# Altium schematic sheet Sheet1.SchDoc
size A3; DocumentNumber: 1; SheetNumber: 1; SheetTotal: 2
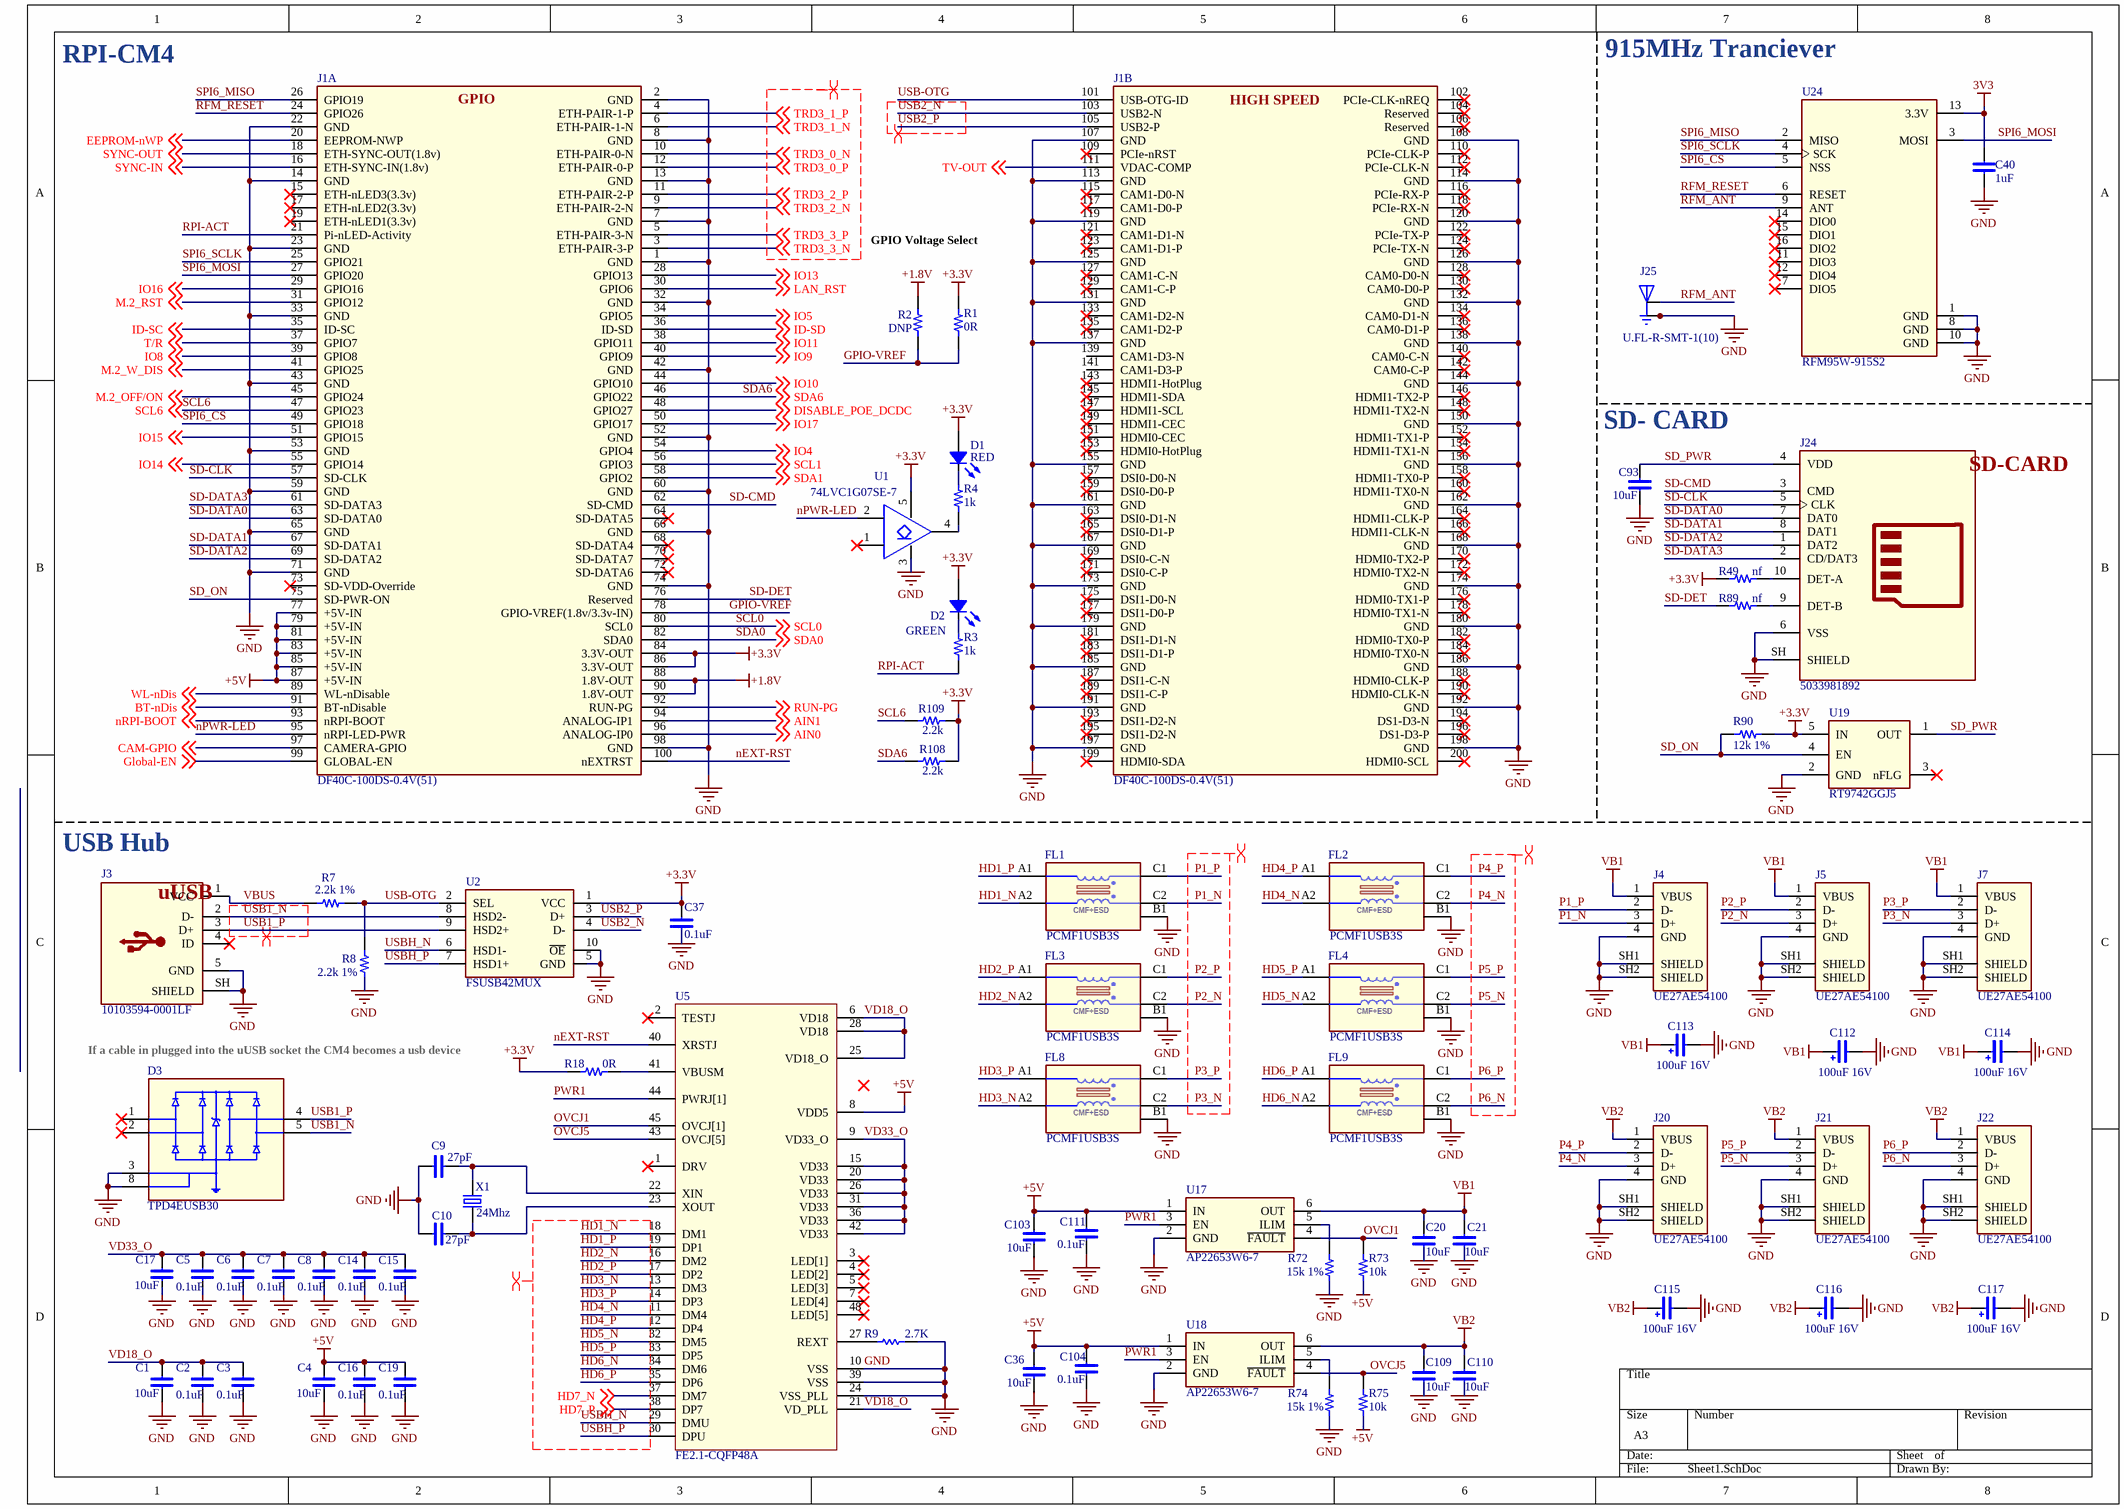
[diagram p0: Sheet1.SchDoc]

## Parts
C1  10uF  [C-0603/1608]
C2  0.1uF  [C-0402/1005]
C3  0.1uF  [C-0402/1005]
C4  10uF  [C-0603/1608]
C5  0.1uF  [C-0402/1005]
C6  0.1uF  [C-0402/1005]
C7  0.1uF  [C-0402/1005]
C8  0.1uF  [C-0402/1005]
C9  27pF  [C-0402/1005]
C10  27pF  [C-0402/1005]
C14  0.1uF  [C-0402/1005]
C15  0.1uF  [C-0402/1005]
C16  0.1uF  [C-0402/1005]
C17  10uF  [C-0603/1608]
C19  0.1uF  [C-0402/1005]
C20  10uF  [C-0603/1608]
C21  10uF  [C-0603/1608]
C36  10uF  [C-0603/1608]
C37  0.1uF  [C-0402/1005]
C40  1uF  [C-0402/1005]
C93  10uF  [C-0805/2012]
C103  10uF  [C-0603/1608]
C104  0.1uF  [C-0402/1005]
C109  10uF  [C-0603/1608]
C110  10uF  [C-0603/1608]
C111  0.1uF  [C-0402/1005]
C112  100uF 16V  [CAP-TAN-2312]
C113  100uF 16V  [CAP-TAN-2312]
C114  100uF 16V  [CAP-TAN-2312]
C115  100uF 16V  [CAP-TAN-2312]
C116  100uF 16V  [CAP-TAN-2312]
C117  100uF 16V  [CAP-TAN-2312]
D1  RED  [LED-0603-RED]
D2  GREEN  [LED-0603-Green]
D3  TPD4EUSB30  [10-USON (2.5x1)]
FL1  PCMF1USB3S  [WLCSP5(2-1-2)_NEX]
FL2  PCMF1USB3S  [WLCSP5(2-1-2)_NEX]
FL3  PCMF1USB3S  [WLCSP5(2-1-2)_NEX]
FL4  PCMF1USB3S  [WLCSP5(2-1-2)_NEX]
FL8  PCMF1USB3S  [WLCSP5(2-1-2)_NEX]
FL9  PCMF1USB3S  [WLCSP5(2-1-2)_NEX]
J1  DF40C-100DS-0.4V(51)  [RPI-CM4]  (parts A,B of 2)
J3  10103594-0001LF  [USB-micro]
J4  UE27AE54100  [AMPHENOL_UE27AE54100]
J5  UE27AE54100  [AMPHENOL_UE27AE54100]
J7  UE27AE54100  [AMPHENOL_UE27AE54100]
J20  UE27AE54100  [AMPHENOL_UE27AE54100]
J21  UE27AE54100  [AMPHENOL_UE27AE54100]
J22  UE27AE54100  [AMPHENOL_UE27AE54100]
J24  5033981892  [MOLEX-503398-1892]
J25  U.FL-R-SMT-1(10)  [HRS_U.FL-R-SMT-1(10)]
R1  0R  [R-0603/1608]
R2  DNP  [R-0603/1608]
R3  1k  [R-0402/1005]
R4  1k  [R-0402/1005]
R7  2.2k 1%  [R-0402/1005]
R8  2.2k 1%  [R-0402/1005]
R9  value 2.7K  [R-0402/1005]
R18  0R  [R-0402/1005]
R49  nf  [R-0402/1005]
R72  15k 1%  [R-0402/1005]
R73  10k  [R-0402/1005]
R74  15k 1%  [R-0402/1005]
R75  10k  [R-0402/1005]
R89  nf  [R-0402/1005]
R90  12k 1%  [R-0402/1005]
R108  2.2k  [R-0402/1005]
R109  2.2k  [R-0402/1005]
U1  74LVC1G07SE-7  [SOT-353]
U2  FSUSB42MUX  [10-MSOP-W3.0mm]
U5  FE2.1-CQFP48A  [PCBComponent_1]
U17  AP22653W6-7  [SOT-23-6]
U18  AP22653W6-7  [SOT-23-6]
U19  RT9742GGJ5  [SOT-23-5]
U24  RFM95W-915S2  [XCVR_RFM95W-915S2]
X1  24Mhz  [HC-49/US]

## Nets
3V3: C40.1 U24.13(3.3V)
+1.8V: J1.88(1.8V-OUT) J1.90(1.8V-OUT) R2.2
+3.3V: C37.1 D1.1 D2.1 J1.84(3.3V-OUT) J1.86(3.3V-OUT) R1.2 R18.1 R49.2 R90.1 R108.1 R109.1 U1.5 U2.1(VCC) U19.5(IN)
+5V: C4.1 C16.1 C19.1 C36.1 C103.1 C104.1 C111.1 J1.77(+5V-IN) J1.79(+5V-IN) J1.81(+5V-IN) J1.83(+5V-IN) J1.85(+5V-IN) J1.87(+5V-IN) R73.2 R75.2 U5.8(VDD5) U17.1(IN) U18.1(IN)
GND: C1.2 C2.2 C3.2 C4.2 C5.2 C6.2 C7.2 C8.2 C9.2 C10.2 C14.2 C15.2 C16.2 C17.2 C19.2 C20.2 C21.2 C36.2 C37.2 C40.2 C93.2 C103.2 C104.2 C109.2 C110.2 C111.2 C112.- C113.- C114.- C115.- C116.- C117.- D3.3(GND_3) D3.8(GND_8) FL1.B1(GND) FL2.B1(GND) FL3.B1(GND) FL4.B1(GND) FL8.B1(GND) FL9.B1(GND) J1.1(GND) J1.2(GND) J1.7(GND) J1.8(GND) J1.13(GND) J1.14(GND) J1.22(GND) J1.23(GND) J1.32(GND) J1.33(GND) J1.42(GND) J1.43(GND) J1.52(GND) J1.53(GND) J1.59(GND) J1.60(GND) J1.65(GND) J1.66(GND) J1.71(GND) J1.74(GND) J1.98(GND) J1.107(GND) J1.108(GND) J1.113(GND) J1.114(GND) J1.119(GND) J1.120(GND) J1.125(GND) J1.126(GND) J1.131(GND) J1.132(GND) J1.137(GND) J1.138(GND) J1.144(GND) J1.150(GND) J1.155(GND) J1.156(GND) J1.161(GND) J1.162(GND) J1.167(GND) J1.168(GND) J1.173(GND) J1.174(GND) J1.179(GND) J1.180(GND) J1.185(GND) J1.186(GND) J1.191(GND) J1.192(GND) J1.197(GND) J1.198(GND) J3.5(GND) J3.SH(SHIELD) J4.4(GND) J4.SH1(SHIELD) J4.SH2(SHIELD) J5.4(GND) J5.SH1(SHIELD) J5.SH2(SHIELD) J7.4(GND) J7.SH1(SHIELD) J7.SH2(SHIELD) J20.4(GND) J20.SH1(SHIELD) J20.SH2(SHIELD) J21.4(GND) J21.SH1(SHIELD) J21.SH2(SHIELD) J22.4(GND) J22.SH1(SHIELD) J22.SH2(SHIELD) J24.6(VSS) J24.SH(SHIELD) J25.1(GND) J25.3(GND) R8.2 R9.2 R72.1 R74.1 U1.3 U2.5(GND) U2.10(~{OE}) U5.10(VSS) U5.24(VSS_PLL) U5.39(VSS) U17.2(GND) U18.2(GND) U19.2(GND) U24.1(GND) U24.8(GND) U24.10(GND)
VB1: C20.1 C21.1 C112.+ C113.+ C114.+ J4.1(VBUS) J5.1(VBUS) J7.1(VBUS) U17.6(OUT)
VB2: C109.1 C110.1 C115.+ C116.+ C117.+ J20.1(VBUS) J21.1(VBUS) J22.1(VBUS) U18.6(OUT)
AIN0: J1.96(ANALOG-IP0) ; off-sheet AIN0
AIN1: J1.94(ANALOG-IP1) ; off-sheet AIN1
BT-nDis: J1.91(BT-nDisable) ; off-sheet BT-nDis
CAM-GPIO: J1.97(CAMERA-GPIO) ; off-sheet CAM-GPIO
DISABLE_POE_DCDC: J1.48(GPIO27) ; off-sheet DISABLE_POE_DCDC
EEPROM-nWP: J1.20(EEPROM-NWP) ; off-sheet EEPROM-nWP
Global-EN: J1.99(GLOBAL-EN) ; off-sheet Global-EN
GPIO-VREF: J1.78(GPIO-VREF(1.8v/3.3v-IN)) R1.1 R2.1
HD1_N: FL1.A2(CH1_IN-) U5.18(DM1)
HD1_P: FL1.A1(CH1_IN+) U5.19(DP1)
HD2_N: FL3.A2(CH1_IN-) U5.16(DM2)
HD2_P: FL3.A1(CH1_IN+) U5.17(DP2)
HD3_N: FL8.A2(CH1_IN-) U5.13(DM3)
HD3_P: FL8.A1(CH1_IN+) U5.14(DP3)
HD4_N: FL2.A2(CH1_IN-) U5.11(DM4)
HD4_P: FL2.A1(CH1_IN+) U5.12(DP4)
HD5_N: FL4.A2(CH1_IN-) U5.32(DM5)
HD5_P: FL4.A1(CH1_IN+) U5.33(DP5)
HD6_N: FL9.A2(CH1_IN-) U5.34(DM6)
HD6_P: FL9.A1(CH1_IN+) U5.35(DP6)
HD7_N: U5.37(DM7) ; off-sheet HD7_N
HD7_P: U5.38(DP7) ; off-sheet HD7_P
ID-SC: J1.35(ID-SC) ; off-sheet ID-SC
ID-SD: J1.36(ID-SD) ; off-sheet ID-SD
IO4: J1.54(GPIO4) ; off-sheet IO4
IO5: J1.34(GPIO5) ; off-sheet IO5
IO8: J1.39(GPIO8) ; off-sheet IO8
IO9: J1.40(GPIO9) ; off-sheet IO9
IO10: J1.44(GPIO10) ; off-sheet IO10
IO11: J1.38(GPIO11) ; off-sheet IO11
IO13: J1.28(GPIO13) ; off-sheet IO13
IO14: J1.55(GPIO14) ; off-sheet IO14
IO15: J1.51(GPIO15) ; off-sheet IO15
IO16: J1.29(GPIO16) ; off-sheet IO16
IO17: J1.50(GPIO17) ; off-sheet IO17
LAN_RST: J1.30(GPIO6) ; off-sheet LAN_RST
M.2_OFF/ON: J1.45(GPIO24) ; off-sheet M.2_OFF/ON
M.2_RST: J1.31(GPIO12) ; off-sheet M.2_RST
M.2_W_DIS: J1.41(GPIO25) ; off-sheet M.2_W_DIS
nEXT-RST: J1.100(nEXTRST) U5.40(XRSTJ)
nPWR-LED: J1.95(nRPI-LED-PWR) U1.2
nRPI-BOOT: J1.93(nRPI-BOOT) ; off-sheet nRPI-BOOT
OVCJ1: R73.1 U5.45(OVCJ[1]) U17.4(~{FAULT})
OVCJ5: R75.1 U5.43(OVCJ[5]) U18.4(~{FAULT})
P1_N: FL1.C2(CH1_OUT-) J4.3(D+)
P1_P: FL1.C1(CH1_OUT+) J4.2(D-)
P2_N: FL3.C2(CH1_OUT-) J5.3(D+)
P2_P: FL3.C1(CH1_OUT+) J5.2(D-)
P3_N: FL8.C2(CH1_OUT-) J7.3(D+)
P3_P: FL8.C1(CH1_OUT+) J7.2(D-)
P4_N: FL2.C2(CH1_OUT-) J20.3(D+)
P4_P: FL2.C1(CH1_OUT+) J20.2(D-)
P5_N: FL4.C2(CH1_OUT-) J21.3(D+)
P5_P: FL4.C1(CH1_OUT+) J21.2(D-)
P6_N: FL9.C2(CH1_OUT-) J22.3(D+)
P6_P: FL9.C1(CH1_OUT+) J22.2(D-)
PWR1: U5.44(PWRJ[1]) U17.3(EN) U18.3(EN)
RFM_ANT: J25.2(SIG) U24.9(ANT)
RFM_RESET: J1.24(GPIO26) U24.6(RESET)
RPI-ACT: J1.21(Pi-nLED-Activity) R3.2
RUN-PG: J1.92(RUN-PG) ; off-sheet RUN-PG
SCL0: J1.80(SCL0) ; off-sheet SCL0
SCL1: J1.56(GPIO3) ; off-sheet SCL1
SCL6: J1.47(GPIO23) R109.2 ; off-sheet SCL6
SD-CLK: J1.57(SD-CLK) J24.5(CLK)
SD-CMD: J1.62(SD-CMD) J24.3(CMD)
SD-DATA0: J1.63(SD-DATA0) J24.7(DAT0)
SD-DATA1: J1.67(SD-DATA1) J24.8(DAT1)
SD-DATA2: J1.69(SD-DATA2) J24.1(DAT2)
SD-DATA3: J1.61(SD-DATA3) J24.2(CD/DAT3)
SD-DET: J1.76(Reserved) R89.2
SD_ON: J1.75(SD-PWR-ON) R90.2 U19.4(EN)
SD_PWR: C93.1 J24.4(VDD) U19.1(OUT)
SDA0: J1.82(SDA0) ; off-sheet SDA0
SDA1: J1.58(GPIO2) ; off-sheet SDA1
SDA6: J1.46(GPIO22) R108.2 ; off-sheet SDA6
SPI6_CS: J1.49(GPIO18) U24.5(NSS)
SPI6_MISO: J1.26(GPIO19) U24.2(MISO)
SPI6_MOSI: J1.27(GPIO20) U24.3(MOSI)
SPI6_SCLK: J1.25(GPIO21) U24.4(SCK)
SYNC-IN: J1.16(ETH-SYNC-IN(1.8v)) ; off-sheet SYNC-IN
SYNC-OUT: J1.18(ETH-SYNC-OUT(1.8v)) ; off-sheet SYNC-OUT
T/R: J1.37(GPIO7) ; off-sheet T/R
TRD3_0_N: J1.10(ETH-PAIR-0-N) ; off-sheet TRD3_0_N
TRD3_0_P: J1.12(ETH-PAIR-0-P) ; off-sheet TRD3_0_P
TRD3_1_N: J1.6(ETH-PAIR-1-N) ; off-sheet TRD3_1_N
TRD3_1_P: J1.4(ETH-PAIR-1-P) ; off-sheet TRD3_1_P
TRD3_2_N: J1.9(ETH-PAIR-2-N) ; off-sheet TRD3_2_N
TRD3_2_P: J1.11(ETH-PAIR-2-P) ; off-sheet TRD3_2_P
TRD3_3_N: J1.3(ETH-PAIR-3-P) ; off-sheet TRD3_3_N
TRD3_3_P: J1.5(ETH-PAIR-3-N) ; off-sheet TRD3_3_P
TV-OUT: J1.111(VDAC-COMP) ; off-sheet TV-OUT
USB1_N: D3.5(D2-) J3.2(D-) U2.8(HSD2-)
USB1_P: D3.4(D2+) J3.3(D+) U2.9(HSD2+)
USB2_N: J1.103(USB2-N) U2.4(D-)
USB2_P: J1.105(USB2-P) U2.3(D+)
USB-OTG: J1.101(USB-OTG-ID) R7.1 R8.1 U2.2(SEL)
USBH_N: U2.6(HSD1-) U5.29(DMU)
USBH_P: U2.7(HSD1+) U5.30(DPU)
VBUS: J3.1(VCC) R7.2
VD18_O: C1.1 C2.1 C3.1 U5.6(VD18) U5.21(VD_PLL) U5.25(VD18_O) U5.28(VD18)
VD33_O: C5.1 C6.1 C7.1 C8.1 C14.1 C15.1 C17.1 U5.9(VD33_O) U5.15(VD33) U5.20(VD33) U5.26(VD33) U5.31(VD33) U5.36(VD33) U5.42(VD33)
WL-nDis: J1.89(WL-nDisable) ; off-sheet WL-nDis
NetC9_1: C9.1 U5.22(XIN) X1.2
NetC10_1: C10.1 U5.23(XOUT) X1.1
NetD1_2: D1.2 R4.1
NetD2_2: D2.2 R3.1
NetJ24_9: J24.9(DET-B) R89.1
NetJ24_10: J24.10(DET-A) R49.1
NetR4_2: R4.2 U1.4
NetR9_1: R9.1 U5.27(REXT)
NetR18_2: R18.2 U5.41(VBUSM)
NetR72_2: R72.2 U17.5(ILIM)
NetR74_2: R74.2 U18.5(ILIM)

Not connected (* = marked no-connect by the designer): D3 1(D1+)* 2(D1-)*; J1 15(ETH-nLED3(3.3v))* 17(ETH-nLED2(3.3v))* 19(ETH-nLED1(3.3v))* 64(SD-DATA5)* 68(SD-DATA4)* 70(SD-DATA7)* 72(SD-DATA6)* 73(SD-VDD-Override)* 102(PCIe-CLK-nREQ)* 104(Reserved)* 106(Reserved)* 109(PCIe-nRST)* 110(PCIe-CLK-P)* 112(PCIe-CLK-N)* 115(CAM1-D0-N)* 116(PCIe-RX-P)* 117(CAM1-D0-P)* 118(PCIe-RX-N)* 121(CAM1-D1-N)* 122(PCIe-TX-P)* 123(CAM1-D1-P)* 124(PCIe-TX-N)* 127(CAM1-C-N)* 128(CAM0-D0-N)* 129(CAM1-C-P)* 130(CAM0-D0-P)* 133(CAM1-D2-N)* 134(CAM0-D1-N)* 135(CAM1-D2-P)* 136(CAM0-D1-P)* 139(CAM1-D3-N) 140(CAM0-C-N)* 141(CAM1-D3-P) 142(CAM0-C-P)* 143(HDMI1-HotPlug)* 145(HDMI1-SDA)* 146(HDMI1-TX2-P)* 147(HDMI1-SCL)* 148(HDMI1-TX2-N)* 149(HDMI1-CEC)* 151(HDMI0-CEC)* 152(HDMI1-TX1-P)* 153(HDMI0-HotPlug)* 154(HDMI1-TX1-N)* 157(DSI0-D0-N)* 158(HDMI1-TX0-P)* 159(DSI0-D0-P)* 160(HDMI1-TX0-N)* 163(DSI0-D1-N)* 164(HDMI1-CLK-P)* 165(DSI0-D1-P)* 166(HDMI1-CLK-N)* 169(DSI0-C-N)* 170(HDMI0-TX2-P)* 171(DSI0-C-P)* 172(HDMI0-TX2-N)* 175(DSI1-D0-N)* 176(HDMI0-TX1-P)* 177(DSI1-D0-P)* 178(HDMI0-TX1-N)* 181(DSI1-D1-N)* 182(HDMI0-TX0-P)* 183(DSI1-D1-P)* 184(HDMI0-TX0-N)* 187(DSI1-C-N)* 188(HDMI0-CLK-P)* 189(DSI1-C-P)* 190(HDMI0-CLK-N)* 193(DSI1-D2-N)* 194(DS1-D3-N)* 195(DSI1-D2-N)* 196(DS1-D3-P)* 199(HDMI0-SDA)* 200(HDMI0-SCL)*; J3 4(ID)*; U1 1*; U5 1(DRV)* 2(TESTJ)* 3(LED[1])* 4(LED[2])* 5(LED[3])* 7(LED[4])* 48(LED[5])*; U19 3(nFLG)*; U24 7(DIO5)* 11(DIO3)* 12(DIO4)* 14(DIO0)* 15(DIO1)* 16(DIO2)*

## Layout directives
differential pair; differential pair class 90OHM: HD1_N, HD1_P, HD2_N, HD2_P, HD3_N, HD3_P, HD4_N, HD4_P, HD5_N, HD5_P, HD6_N, HD6_P, HD7_N, HD7_P, P1_N, P1_P, P2_N, P2_P, P3_N, P3_P, P4_N, P4_P, P5_N, P5_P, P6_N, P6_P, USB1_N, USB1_P, USB2_N, USB2_P, USBH_N, USBH_P
differential pair; differential pair class 100OHM: TRD3_0_N, TRD3_0_P, TRD3_1_N, TRD3_1_P, TRD3_2_N, TRD3_2_P, TRD3_3_N, TRD3_3_P

## Notes on the sheet
- RPI-CM4
- (near U24) 915MHz Tranciever
- GPIO Voltage Select
- (near C93) SD- CARD
- USB Hub
- If a cable in plugged into the uUSB socket the CM4 becomes a usb device
- (in symbol Nexperia, PCMF1USB3SZ) CMF+ESD
- (in symbol RPICM4, part A) GPIO
- (in symbol RPICM4, part B) HIGH SPEED
- (in symbol USB-Micro) uUSB

## Library data of the parts
C1 C4 C17 C20 C21 C36 C93 C103 C109 C110 = Capacitor-NonPolar: CAP CER 10UF 10V X7R 0805; Mfr. Part No.: GRM21BR71A106KA73K; Unit Price (USD): 0.19; Value: 10uF 10V; Supplier Part No.: 490-14381-1-ND; Supplier: Digikey Electronics
C2 C3 C5-C8 C14-C16 C19 C37 C104 C111 = Capacitor-NonPolar: CAP CER 0.1UF 16V X7R 0402; Mfr. Part No.: GCM155R71C104KA55D; Unit Price (USD): 0.1; Value: 0.1uF 16V; Supplier Part No.: 490-4759-1-ND; Supplier: Digikey Electronics
C9 C10 = Capacitor-NonPolar: CAP CER 27PF 50V CH 0402; Mfr. Part No.: UMK105CH270JVHF; Unit Price (USD): 0.1; Value: 27pF 50V; Supplier Part No.: 587-5076-1-ND; Supplier: Digikey Electronics
C40 = Capacitor-NonPolar: CAP CER 0.1UF 50V X7R 0402; Mfr. Part No.: UMK105B7104KV-FR; Value: 100nF; Unit Price (USD): 0.15; Supplier Part No.: 587-3498-1-ND; Supplier: Digikey Electronics
C112-C117 = Capacitor-Polar: CAP TANT 10UF 10% 16V 1206; Mfr. Part No.: F931C106KAAAJ6; Unit Price (USD): 0.67; Value: 10uF 16V; Supplier Part No.: 478-10723-1-ND; Supplier: Digikey Electronics
D1 = LED SMD: LED RED CLEAR CHIP SMD R/A; Mfr. Part No.: LTST-S270KRKT; Unit Price (USD): 0.24; Supplier Part No.: 160-1479-1-ND; Supplier: Digikey Electronics
D2 = LED SMD: LED GREEN CLEAR CHIP SMD R/A; Mfr. Part No.: LTST-S270KGKT; Unit Price (USD): 0.24; Supplier Part No.: 160-1478-1-ND; Supplier: Digikey Electronics
D3 = TPD4EUSB30: TVS DIODE 5.5V 8V 10USON; Mfr. Part No.: TPD4EUSB30DQAR; Unit Price (USD): 0.79; Supplier Part No.: 296-28063-1-ND; Supplier: Digikey Electronics
FL1-FL4 FL8 FL9 = Nexperia, PCMF1USB3SZ: FLT, SMT, WLCSP5, Common Mode EMI Filters; Supply Voltage: NO; Notes: NC; Value: PCMF1USB3S; Manufacturer: Nexperia; Mounting: SMT; Operating Temperature: -40ºC ~ +125ºC; Subpart Type: Common Mode EMI Filters; Footprint: WLCSP5; Manufacturer Part Number: PCMF1USB3S; Datasheet Link: https://www.nexperia.com/products/esd-protection-tvs-filtering-and-signal-conditioning/emi-solutions-with-integrated-protection/common-mode-filters-with-integrated-protection/PCMF1USB3S.html; Supply Current: NO; Substitutes Allowed: NO; Height: 0.6mm
J1 = RPICM4: CONN RCPT 100POS SMD GOLD; Unit Price (USD): 1.73; Supplier: Digikey Electronics; Supplier Part No.: H11615CT-ND; Mfr. Part No.: DF40C-100DS-0.4V(51)
J3 = USB-Micro: CONN RCPT USB2.0 MICRO B SMD R/A; Unit Price (USD): 0.72; Mfr. Part No.: 10103594-0001LF; Supplier Part No.: 609-4050-1-ND; Supplier: Digikey Electronics
J4 J5 J7 J20-J22 = UE27AE54100: MF: {'manufacturer': u'Amphenol ICC (Commercial Products)'}; Package: None; Price: None; Value: *; MP: UE27AE54100; Availability: Unavailable
J24 = SD-CARD: MICRO SD PUSH/PUSH SMALL 8C; Unit Price (USD): 2.41; Mfr. Part No.: 5033981892; Supplier Part No.: WM11190CT-ND; Supplier: Digikey Electronics
J25 = U.FL-R-SMT-1(10): U.FL Series 6 Ghz 50 Ohm Ultra-small SMT Coaxial Cable Receptacle; Availability: Unavailable; MP: U.FL-R-SMT-1(10); Value: *; Price: None; Package: None
R1 = Resistor: RESA-AS 0805 0R JUMPER 125MW; Mfr. Part No.: CR0805AJ/-000EAS; Unit Price (USD): 0.1; Value: 0R; Supplier Part No.: CR0805AJ/-000EASCT-ND; Supplier: Digikey Electronics
R2 = Resistor: CRGCQ 0402 470R 1%; Value: nf; Unit Price (USD): 0; Mfr. Part No.: nf; Supplier Part No.: nf; Supplier: nf
R3 R4 R49 R73 R75 R89 R108 R109 = Resistor: RES SMD 1K OHM 1% 1/16W 0402; Mfr. Part No.: RC0402FR-071KL; Unit Price (USD): 0.1; Value: 1k; Supplier Part No.: 311-1.00KLRCT-ND; Supplier: Digikey Electronics
R7 R8 = Resistor: RES SMD 2.2K OHM 1% 1/16W 0402; Mfr. Part No.: RT0402FRE072K2L; Unit Price (USD): 0.1; Value: 2.2k 1%; Supplier Part No.: 13-RT0402FRE072K2LCT-ND; Supplier: Digikey Electronics
R9 = Res1: Resistor; Published: 8-Jun-2000; LatestRevisionDate: 17-Jul-2002; LatestRevisionNote: Re-released for DXP Platform.; PackageReference: AXIAL-0.3; Publisher: Altium Limited; PackageDescription: Axial Device, Thru-Hole; 2 Leads; 0.3 in Pin Spacing
R18 = Resistor: RES SMD 2.2K OHM 1% 1/16W 0402; Mfr. Part No.: RT0402FRE072K2L; Value: 2.2k 1%; Unit Price (USD): 0.1; Supplier Part No.: 13-RT0402FRE072K2LCT-ND; Supplier: Digikey Electronics
R72 R74 = Resistor: RES SMD 15K OHM 1% 1/16W 0402; Mfr. Part No.: MCR01MZPF1502; Unit Price (USD): 0.1; Value: 15k 1%; Supplier Part No.: RHM15.0KLTR-ND; Supplier: Digikey Electronics
R90 = Resistor: RES SMD 12K OHM 1% 1/16W 0402; Mfr. Part No.: MCR01MZPF1202; Unit Price (USD): 0.12; Value: 12k 1%; Supplier Part No.: RHM12.0KLCT-ND; Supplier: Digikey Electronics
U1 = 74LVC1G07SE-7: IC BUF NON-INVERT 5.5V SOT353; Unit Price (USD): 0.26; Mfr. Part No.: 74LVC1G07SE-7; Supplier Part No.: 74LVC1G07SE-7DICT-ND; Supplier: Digikey Electronics
U2 = FSUSB42MUX: IC USB SWITCH DPDT 10MSOP; Unit Price (USD): 0.6; Mfr. Part No.: FSUSB42MUX; Supplier Part No.: FSUSB42MUXCT-ND; Supplier: Digikey Electronics
U5 = Component_1
U17 U18 = AP22653W6-7: LOAD SWITCH,SOT26,T&R,3K; Unit Price (USD): 0.42; Supplier Part No.: 31-AP22653W6-7CT-ND; Mfr. Part No.: AP22653W6-7; Supplier: Digikey Electronics
U19 = RT9742GGJ5: IC PWR SWTCH N-CHAN 1:1 TSOT23-5; Unit Price (USD): 1.52; Supplier Part No.: 1028-1436-1-ND; Mfr. Part No.: RT9742GGJ5; Supplier: Digikey Electronics
U24 = RFM95W-915S2: RFM95(W) - Low Power Long Range Transceiver Module V1.0; Availability: Unavailable; MP: RFM95W-915S2; Value: *; Package: None; Price: None
X1 = ST3215SB32768C0HPWBB: CRYSTAL 24.0000MHZ 18PF TH; Mfr. Part No.: ECS-240-18-4XEN; Unit Price (USD): 0.66; Supplier: Digikey Electronics; Supplier Part No.: XC1725-ND